# Altium schematic sheet BluePillShematic.SchDoc
size A
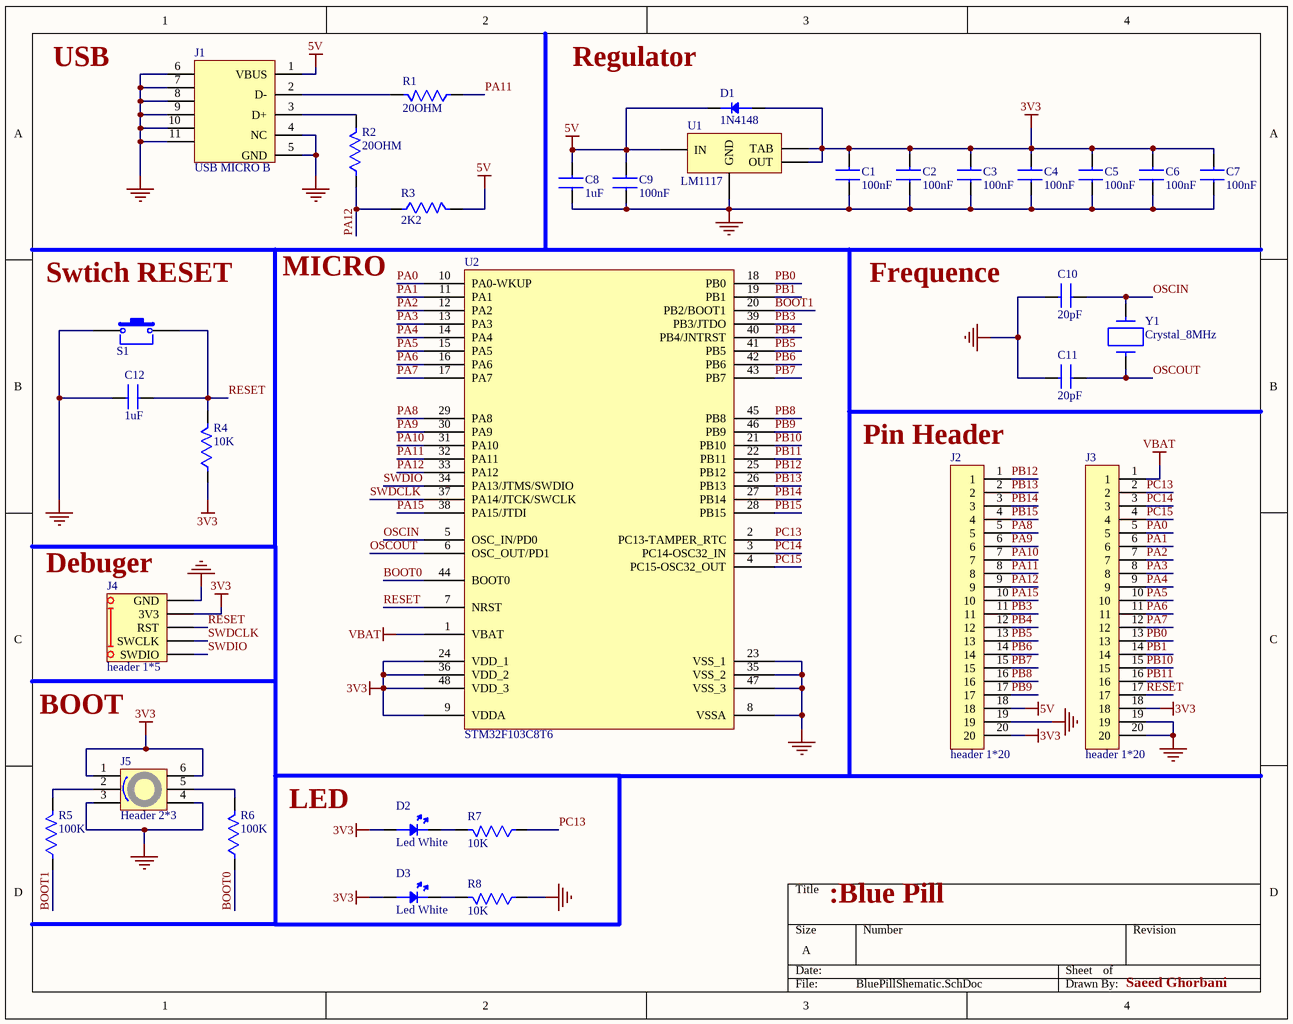
[diagram p0: BluePillShematic.SchDoc]

## Parts
C1  100nF  [C0805]
C2  100nF  [C0805]
C3  100nF  [C0805]
C4  100nF  [C0805]
C5  100nF  [C0805]
C6  100nF  [C0805]
C7  100nF  [C0805]
C8  1uF  [C0805]
C9  100nF  [C0805]
C10  20pF  [C0805]
C11  20pF  [C0805]
C12  1uF  [C0805]
D1  1N4148  [DO-213-A]
D2  Led White  [LED0603]
D3  Led White  [LED0603]
J1  USB MICRO B  [USB]
J2  header 1*20  [header 1*20]
J3  header 1*20  [header 1*20]
J4  header 1*5  [header 1*5]
J5  Header 2*3  [header 2*3]
R1  20OHM  [R0805]
R2  20OHM  [R0805]
R3  2K2  [R0805]
R4  10K  [R0805]
R5  100K  [R0805]
R6  100K  [R0805]
R7  10K  [R0805]
R8  10K  [R0805]
S1  PTS636SMG25JSMTRLFS  [Switch Reset]  (value not drawn)
U1  LM1117  [LM1117_SOP]
U2  STM32F103C8T6  [TQFP48]
Y1  Crystal_8MHz  [Crystal_8MHz]

## Nets
3V3: C1.2 C2.2 C3.2 C4.2 C5.2 C6.2 C7.2 D1.A(Anode) D2.A(Anode) D3.A(Anode) J2.20 J3.18 J4.2(3V3) J5.1 J5.6 R4.1 U1.2(OUT) U1.4(TAB) U2.9(VDDA) U2.24(VDD_1) U2.36(VDD_2) U2.48(VDD_3)
5V: C8.2 C9.2 D1.K(Cathode) J1.1(VBUS) J2.18 R3.2 U1.3(IN)
GND: C1.1 C2.1 C3.1 C4.1 C5.1 C6.1 C7.1 C8.1 C9.1 C10.1 C11.1 C12.1 J1.4(NC) J1.5(GND) J1.6(GND) J1.7(GND) J1.8(GND) J1.9(GND) J1.10(GND) J1.11(GND) J2.19 J3.19 J3.20 J4.1(GND) J5.3 J5.4 R8.1 S1.1 U1.1(GND) U2.8(VSSA) U2.23(VSS_1) U2.35(VSS_2) U2.47(VSS_3)
VBAT: J3.1 U2.1(VBAT)
BOOT0: R6.1 U2.44(BOOT0)
BOOT1: R5.1 U2.20(PB2/BOOT1)
OSCIN: C10.2 U2.5(OSC_IN/PD0) Y1.2
OSCOUT: C11.2 U2.6(OSC_OUT/PD1) Y1.1
PA0: J3.5 U2.10(PA0-WKUP)
PA1: J3.6 U2.11(PA1)
PA2: J3.7 U2.12(PA2)
PA3: J3.8 U2.13(PA3)
PA4: J3.9 U2.14(PA4)
PA5: J3.10 U2.15(PA5)
PA6: J3.11 U2.16(PA6)
PA7: J3.12 U2.17(PA7)
PA8: J2.5 U2.29(PA8)
PA9: J2.6 U2.30(PA9)
PA10: J2.7 U2.31(PA10)
PA11: J2.8 R1.1 U2.32(PA11)
PA12: J2.9 R2.1 R3.1 U2.33(PA12)
PA15: J2.10 U2.38(PA15/JTDI)
PB0: J3.13 U2.18(PB0)
PB1: J3.14 U2.19(PB1)
PB3: J2.11 U2.39(PB3/JTDO)
PB4: J2.12 U2.40(PB4/JNTRST)
PB5: J2.13 U2.41(PB5)
PB6: J2.14 U2.42(PB6)
PB7: J2.15 U2.43(PB7)
PB8: J2.16 U2.45(PB8)
PB9: J2.17 U2.46(PB9)
PB10: J3.15 U2.21(PB10)
PB11: J3.16 U2.22(PB11)
PB12: J2.1 U2.25(PB12)
PB13: J2.2 U2.26(PB13)
PB14: J2.3 U2.27(PB14)
PB15: J2.4 U2.28(PB15)
PC13: J3.2 R7.1 U2.2(PC13-TAMPER_RTC)
PC14: J3.3 U2.3(PC14-OSC32_IN)
PC15: J3.4 U2.4(PC15-OSC32_OUT)
RESET: C12.2 J3.17 J4.3(RST) R4.2 S1.2 U2.7(NRST)
SWDCLK: J4.4(SWCLK) U2.37(PA14/JTCK/SWCLK)
SWDIO: J4.5(SWDIO) U2.34(PA13/JTMS/SWDIO)
NetD2_K: D2.K(Cathode) R7.2
NetD3_K: D3.K(Cathode) R8.2
NetJ1_2: J1.2(D-) R1.2
NetJ1_3: J1.3(D+) R2.2
NetJ5_2: J5.2 R5.2
NetJ5_5: J5.5 R6.2

## Notes on the sheet
- USB
- (near D1) Regulator
- (near S1) Swtich RESET
- MICRO
- Frequence
- (near J2) Pin Header
- (near J4) Debuger
- BOOT
- LED
- :Blue Pill
- Saeed Ghorbani

## Library data of the parts
C1-C7 C9 = C0805_100nF: Cap Ceramic 0.1uF 50V X7R 10% Pad SMD 0805 (1%FR) 125C; Manufacturer: KEMET; Manufacturer Part Number: M3253504E2A104KZMB; Supplier 1: Digi-Key; RoHS: No; Stock 1: 3225; Pricing 1: 1=6.48000, 10=5.76300, 50=5.04240, 100=4.61010, 500=3.96184, 1000=3.67371 (USD); RoHS Compliant: No; ComponentLink1URL: https://api.kemet.com/component-edge/download/datasheet/M3253504E2A104KZMB.pdf?src-supplier=Digi-Key; ComponentLink1Description: https://api.kemet.com/component-edge/download/datasheet/M3253504E2A104KZMB.pdf?src-supplier=Digi-Key; Supplier Part Number 1: 1001-2517-1-ND
C8 C12 = C0805_1uF: KEMET         C0805C105K5PACTU             SMD Multilayer Ceramic Capacitor, 0805 [2012 Metric], 1 F, 50 V,  10%, X5R, C Series; Voltage Rating: 50V; Supplier 1: Digi-Key; Manufacturer: KEMET; Manufacturer Part Number: C0805C105K5PACTU; RoHS: Yes; Category: Ceramic Capacitors; Stock 1: 4156; Pricing 1: 1=0.37000, 10=0.25000, 50=0.16700, 100=0.14190, 500=0.10018, 1000=0.08766 (USD); Mount: Surface Mount; Case/Package: 0805; Dielectric Material: Ceramic; Case Code (Metric): 2012; Case Code (Imperial): 0805; Weight: 0.000194oz; Min Operating Temperature: -55°C; Max Operating Temperature: 85°C; Dielectric: X5R; Packaging: Tape and Reel; Tolerance: 10%; Capacitance: 1uF; Termination: SMD/SMT; Voltage Rating (DC): 50V; Package Quantity: 2500; Length: 0.079inch; Width: 0.049inch; Thickness: 0.055inch; Lead Free: Lead Free; REACH SVHC: No SVHC; ComponentLink1URL: http://www.farnell.com/datasheets/2746140.pdf?src-supplier=Farnell; ComponentLink1Description: http://www.farnell.com/datasheets/2746140.pdf?src-supplier=Farnell; ComponentLink2URL: http://www.mouser.com/ds/2/212/KEM_C1006_X5R_SMD-1103249.pdf?src-supplier=Mouser; ComponentLink2Description: http://www.mouser.com/ds/2/212/KEM_C1006_X5R_SMD-1103249.pdf?src-supplier=Mouser; ComponentLink3URL: https://api.kemet.com/component-edge/download/datasheet/C0805C105K5PAC7800.pdf?src-supplier=Digi-Key; ComponentLink3Description: https://api.kemet.com/component-edge/download/datasheet/C0805C105K5PAC7800.pdf?src-supplier=Digi-Key; ComponentLink4URL: http://www.farnell.com/datasheets/2746140.pdf?src-supplier=Newark; ComponentLink4Description: http://www.farnell.com/datasheets/2746140.pdf?src-supplier=Newark; ComponentLink5URL: http://www.farnell.com/datasheets/2032728.pdf?src-supplier=Element14; ComponentLink5Description: http://www.farnell.com/datasheets/2032728.pdf?src-supplier=Element14; Supplier Part Number 1: 399-15436-1-ND
C10 C11 = C0805_20pF: Cap Ceramic 20pF 50V C0G 10% SMD 0805 125°C Paper T/R; Manufacturer: KEMET; Manufacturer Part Number: C0805C200K5GAC7800; Supplier 1: Digi-Key; RoHS: Yes; Category: Ceramic Capacitors; Stock 1: 273; Pricing 1: 1=0.29000, 10=0.19700, 50=0.13120, 100=0.11140, 500=0.07866, 1000=0.06883 (USD); Case/Package: 0805; Dielectric Material: Ceramic; Voltage Rating (DC): 50V; Capacitance: 20pF; Tolerance: 10%; Lead Free: Lead Free; ComponentLink1URL: https://api.kemet.com/component-edge/download/datasheet/C0805C200K5GACTU.pdf?src-supplier=Digi-Key; ComponentLink1Description: https://api.kemet.com/component-edge/download/datasheet/C0805C200K5GACTU.pdf?src-supplier=Digi-Key; Supplier Part Number 1: 399-14568-1-ND
D1 = 1N4148UR-1: Diode Switching 75V 0.2A 2-Pin DO-213AA; Manufacturer: Microsemi; Max Reverse Current: 500nA; Element Configuration: Single; Average Rectified Current: 200mA; Reverse Recovery Time: 5ns; Peak Non-Repetitive Surge Current: 2A; Forward Voltage: 1.2V; Supplier 1: Newark; Manufacturer Part Number: 1N4148UR-1; RoHS: No; Category: Rectifier Diodes; Pricing 1: 491=0.66300 (USD); Mount: Surface Mount; Number of Pins: 2; Min Operating Temperature: -65°C; Max Operating Temperature: 175°C; Max Repetitive Reverse Voltage (Vrrm): 75V; Max Reverse Voltage (DC): 75V; Forward Current: 200mA; Packaging: Bulk; Radiation Hardening: No; Lead Free: Lead Free; ComponentLink1URL: https://datasheet.ciiva.com/3304/lds-0281-1-3304223.pdf?src-supplier=Avnet; ComponentLink1Description: https://datasheet.ciiva.com/3304/lds-0281-1-3304223.pdf?src-supplier=Avnet; Supplier Part Number 1: 34AJ8178
D2 D3 = LED0603: Led White Clear 0603 SMD; Manufacturer: Inolux; Manufacturer Part Number: IN-S63AT5UW; Lens Style: Flat; Luminous Intensity: 900mcd; Forward Voltage: 3V; Test Current: 5mA; Viewing Angle: 120°; Lens Size: 0.8mm; Supplier 1: Digi-Key; RoHS: No; Category: LEDs; Stock 1: 294296; Pricing 1: 1=0.34000, 10=0.18600, 100=0.08610, 500=0.07950, 1000=0.06228, 2000=0.06095 (USD); Mount: Surface Mount; Case/Package: 0603; Color: White; Lens Color: Clear; Case Code (Imperial): 0603; Case Code (Metric): 1608; Packaging: Tape and Reel; Lens Transparency: Clear; Length: 1.6mm; Width: 0.8mm; Height: 0.4mm; ComponentLink1URL: http://www.inolux-corp.com/datasheet/SMDLED/Mono%20Color%20Top%20View/IN-S63AT%20Series_V1.1.pdf?src-supplier=Digi-Key; ComponentLink1Description: http://www.inolux-corp.com/datasheet/SMDLED/Mono%20Color%20Top%20View/IN-S63AT%20Series_V1.1.pdf?src-supplier=Digi-Key; Supplier Part Number 1: 1830-1063-1-ND
J1 = USB MICRO B: CONN USB MICRO B RECPT SMT R/A; Manufacturer: Amphenol ICC / FCI; Manufacturer Part Number: 10118194-0001LF; Supplier 1: Newark; RoHS: No; Category: USB Connectors; Stock 1: 24134; Pricing 1: 1=0.24700, 25=0.24700, 100=0.24700, 250=0.22600, 500=0.22600 (USD); ComponentLink1URL: http://components.arrow.com/part/dataview/0323_04107373?src-supplier=Arrow+Europe; ComponentLink1Description: http://components.arrow.com/part/dataview/0323_04107373?src-supplier=Arrow+Europe; ComponentLink2URL: https://cdn.amphenol-icc.com/media/wysiwyg/files/drawing/10118194.pdf?src-supplier=Avnet; ComponentLink2Description: https://cdn.amphenol-icc.com/media/wysiwyg/files/drawing/10118194.pdf?src-supplier=Avnet; ComponentLink3URL: http://www.farnell.com/datasheets/2366786.pdf?src-supplier=Newark; ComponentLink3Description: http://www.farnell.com/datasheets/2366786.pdf?src-supplier=Newark; ComponentLink4URL: https://cdn.amphenol-icc.com/media/wysiwyg/files/drawing/10118194.pdf?src-supplier=Mouser; ComponentLink4Description: https://cdn.amphenol-icc.com/media/wysiwyg/files/drawing/10118194.pdf?src-supplier=Mouser; ComponentLink5URL: http://www.amphenol-icc.com/media/wysiwyg/files/drawing/10118194.pdf?src-supplier=Digi-Key; ComponentLink5Description: http://www.amphenol-icc.com/media/wysiwyg/files/drawing/10118194.pdf?src-supplier=Digi-Key; ComponentLink6URL: http://www.farnell.com/cad/2354948.pdf?src-supplier=Farnell; ComponentLink6Description: http://www.farnell.com/cad/2354948.pdf?src-supplier=Farnell; ComponentLink7URL: https://cdn.amphenol-icc.com/media/wysiwyg/files/drawing/10118194.pdf?src-supplier=RSComponents; ComponentLink7Description: https://cdn.amphenol-icc.com/media/wysiwyg/files/drawing/10118194.pdf?src-supplier=RSComponents; ComponentLink8URL: https://cdn.amphenol-icc.com/media/wysiwyg/files/drawing/10118194.pdf?src-supplier=Allied+Electronics; ComponentLink8Description: https://cdn.amphenol-icc.com/media/wysiwyg/files/drawing/10118194.pdf?src-supplier=Allied+Electronics; ComponentLink9URL: https://cdn.amphenol-icc.com/media/wysiwyg/files/drawing/10118194.pdf?src-supplier=Verical; ComponentLink9Description: https://cdn.amphenol-icc.com/media/wysiwyg/files/drawing/10118194.pdf?src-supplier=Verical; ComponentLink10URL: https://cdn.amphenol-icc.com/media/wysiwyg/files/drawing/10118194.pdf?src-supplier=Arrow+Electronics; ComponentLink10Description: https://cdn.amphenol-icc.com/media/wysiwyg/files/drawing/10118194.pdf?src-supplier=Arrow+Electronics; ComponentLink11URL: https://cdn.amphenol-icc.com/media/wysiwyg/files/drawing/10118194.pdf?src-supplier=TTI; ComponentLink11Description: https://cdn.amphenol-icc.com/media/wysiwyg/files/drawing/10118194.pdf?src-supplier=TTI; ComponentLink12URL: https://cdn.amphenol-icc.com/media/wysiwyg/files/drawing/10118194.pdf?src-supplier=NAC+Semi; ComponentLink12Description: https://cdn.amphenol-icc.com/media/wysiwyg/files/drawing/10118194.pdf?src-supplier=NAC+Semi; ComponentLink13URL: https://cdn.amphenol-icc.com/media/wysiwyg/files/drawing/10118194.pdf?src-supplier=SOS+electronic; ComponentLink13Description: https://cdn.amphenol-icc.com/media/wysiwyg/files/drawing/10118194.pdf?src-supplier=SOS+electronic; ComponentLink14URL: https://cdn.amphenol-icc.com/media/wysiwyg/files/drawing/10118194.pdf?src-supplier=Quest; ComponentLink14Description: https://cdn.amphenol-icc.com/media/wysiwyg/files/drawing/10118194.pdf?src-supplier=Quest; ComponentLink15URL: https://cdn.amphenol-icc.com/media/wysiwyg/files/drawing/10118194.pdf?src-supplier=Heilind+Electronics; ComponentLink15Description: https://cdn.amphenol-icc.com/media/wysiwyg/files/drawing/10118194.pdf?src-supplier=Heilind+Electronics; ComponentLink16URL: https://cdn.amphenol-icc.com/media/wysiwyg/files/drawing/10118194.pdf?src-supplier=TME; ComponentLink16Description: https://cdn.amphenol-icc.com/media/wysiwyg/files/drawing/10118194.pdf?src-supplier=TME; Supplier Part Number 1: 67T2260
J2 J3 = header 1*20: 2.54mm (0.1") Pitch SIL Vertical PC Tail Pin Header, 6.1mm mating pin height, gold (hi-temp mould), 20 contacts; Manufacturer: Harwin; Manufacturer Part Number: M20-9992045; Max Current Rating: 3A; Contact Resistance: 25mR; Connector Type: Male Pin; Number of Positions: 20; Gender: Male; Supplier 1: Digi-Key; RoHS: Yes; Category: Headers and Wire Housings; Stock 1: 74; Pricing 1: 1=0.75000, 10=0.65900, 100=0.56880, 500=0.46540, 1000=0.41370, 5000=0.36198, 10000=0.34389 (USD); Mount: Through Hole; Case/Package: SIL; Housing Color: Black; Contact Plating: Gold; Color: Black; Contact Material: Brass; Housing Material: Nylon; Min Operating Temperature: -40°C; Max Operating Temperature: 105°C; Packaging: Bulk; Package Quantity: 200; Termination: Solder; Orientation: Straight; Number of Rows: 1; Number of Contacts: 20; Length: 50.8mm; Pitch: 2.54mm; Contact Mating Length: 0.24inch; Depth: 2.54mm; Radiation Hardening: No; ComponentLink1URL: https://datasheet.ciiva.com/5159/m20-999-351179-5159781.pdf?src-supplier=Mouser; ComponentLink1Description: https://datasheet.ciiva.com/5159/m20-999-351179-5159781.pdf?src-supplier=Mouser; Supplier Part Number 1: 952-3306-ND
J4 = header 1*5: M20 Header,  Pin,  Sil,  Vertical,  5 W; Manufacturer: Harwin; Manufacturer Part Number: M20-9990545; Number of Positions: 5; Connector Type: Male Pin; Gender: Male; Max Current Rating: 3A; Contact Resistance: 25mR; Insulation Resistance: 10GR; Pitch: 2.54mm; Supplier 1: Digi-Key; RoHS: Yes; Category: Headers and Wire Housings; Stock 1: 4725; Pricing 1: 1=0.26000, 10=0.24200, 100=0.16810, 500=0.14220, 1000=0.11635, 5000=0.10342, 10000=0.09373 (USD); Mount: Through Hole; Case/Package: SIL; Housing Material: Nylon; Color: Black; Housing Color: Black; Weight: 0.1lb; Contact Plating: Gold; Contact Material: Brass,Bronze; Min Operating Temperature: -40°C; Max Operating Temperature: 105°C; Termination: Solder; Number of Contacts: 5; Number of Rows: 1; Packaging: Bag; Orientation: Straight; Package Quantity: 1000; Current Rating: 3A; Length: 12.7mm; Width: 0.5inch; Height: 0.12inch; Depth: 2.54mm; Contact Mating Length: 0.24inch; Radiation Hardening: No; REACH SVHC: No SVHC; ComponentLink1URL: https://datasheet.ciiva.com/11753/0900766b80da602d-11753877.pdf?src-supplier=RSComponents; ComponentLink1Description: https://datasheet.ciiva.com/11753/0900766b80da602d-11753877.pdf?src-supplier=RSComponents; ComponentLink2URL: https://datasheet.ciiva.com/9479/m20-999-9479623.pdf?src-supplier=Avnet; ComponentLink2Description: https://datasheet.ciiva.com/9479/m20-999-9479623.pdf?src-supplier=Avnet; ComponentLink3URL: https://datasheet.ciiva.com/8046/315376-8046938.pdf?src-supplier=Element14; ComponentLink3Description: https://datasheet.ciiva.com/8046/315376-8046938.pdf?src-supplier=Element14; ComponentLink4URL: https://datasheet.ciiva.com/6814/m20-999-6814798.pdf?src-supplier=Digi-Key; ComponentLink4Description: https://datasheet.ciiva.com/6814/m20-999-6814798.pdf?src-supplier=Digi-Key; ComponentLink5URL: https://datasheet.ciiva.com/16657/m20-999-16657087.pdf?src-supplier=Avnet+Europe; ComponentLink5Description: https://datasheet.ciiva.com/16657/m20-999-16657087.pdf?src-supplier=Avnet+Europe; Supplier Part Number 1: 952-2267-ND
J5 = Header 2*3: HARWIN - M20-9980345 - Board-To-Board Connector, Vertical, 2.54 mm, 6 Contacts, Header, M20 Series, Through Hole, 2 Rows; Max Current Rating: 3A; Contact Resistance: 25mR; Number of Positions: 6; Gender: Male; Connector Type: Male Pin; Insulation Resistance: 10GR; Pitch: 2.54mm; Row Spacing: 0.1inch; Supplier 1: Digi-Key; Manufacturer: Harwin; Manufacturer Part Number: M20-9980345; RoHS: Yes; Category: Headers and Wire Housings; Stock 1: 3339; Pricing 1: 1=0.29000, 10=0.27600, 100=0.19300, 500=0.16544, 1000=0.13786, 5000=0.11817, 10000=0.11029 (USD); Mount: Through Hole; Contact Material: Brass,Bronze; Color: Black; Housing Color: Black; Housing Material: Nylon; Contact Plating: Gold; Weight: 0.125lb; Insulation Material: Polyester; Min Operating Temperature: -40°C; Max Operating Temperature: 105°C; Package Quantity: 1000; Number of Rows: 2; Packaging: Bag; Termination: Solder; Number of Contacts: 6; Orientation: Straight; Current Rating: 3A; Series: M20; Contact Type: Male Pin; Length: 7.62mm; Width: 0.25inch; Height: 0.125inch; Depth: 5.08mm; Contact Mating Length: 0.24inch; Radiation Hardening: No; REACH SVHC: No SVHC; RoHS Compliant: Yes; ComponentLink1URL: https://datasheet.ciiva.com/6789/91635-6789923.pdf?src-supplier=Newark; ComponentLink1Description: https://datasheet.ciiva.com/6789/91635-6789923.pdf?src-supplier=Newark; ComponentLink2URL: https://datasheet.ciiva.com/11746/0900766b80da602b-11746662.pdf?src-supplier=RSComponents; ComponentLink2Description: https://datasheet.ciiva.com/11746/0900766b80da602b-11746662.pdf?src-supplier=RSComponents; ComponentLink3URL: https://datasheet.ciiva.com/26852/getdatasheetpartid-420465-26852189.pdf?src-supplier=Verical; ComponentLink3Description: https://datasheet.ciiva.com/26852/getdatasheetpartid-420465-26852189.pdf?src-supplier=Verical; ComponentLink4URL: https://datasheet.ciiva.com/6830/m20-998-6830775.pdf?src-supplier=Digi-Key; ComponentLink4Description: https://datasheet.ciiva.com/6830/m20-998-6830775.pdf?src-supplier=Digi-Key; ComponentLink5URL: https://datasheet.ciiva.com/8046/112195-8046904.pdf?src-supplier=Element14; ComponentLink5Description: https://datasheet.ciiva.com/8046/112195-8046904.pdf?src-supplier=Element14; Supplier Part Number 1: 952-2120-ND
R1 R2 = R0805_20OHM: RES SMD 20 OHM 0.1% 1/8W 0805; Manufacturer: Yageo; Manufacturer Part Number: RT0805BRD0720RL; Resistance: 20R; Power Rating: 125mW; Voltage Rating: 150V; Temperature Coefficient: 25ppm/°C; Supplier 1: Digi-Key; RoHS: Yes; Category: Chip SMD Resistors; Stock 1: 12923; Pricing 1: 1=0.36000, 10=0.25900, 100=0.10350, 1000=0.05102, 2500=0.04726 (USD); Case/Package: 0805; Case Code (Metric): 2012; Case Code (Imperial): 0805; Min Operating Temperature: -55°C; Max Operating Temperature: 125°C; Package Quantity: 5000; Packaging: Tape and Reel; Tolerance: 0.1%; Resistor Type: Thin Film; Number of Terminations: 2; Termination: SMD/SMT; Max Power Dissipation: 125mW; Voltage Rating (DC): 150V; Series: RT; Length: 0.079inch; Width: 0.049inch; Height: 0.024inch; Lead Free: Lead Free; RoHS Compliant: Yes; ComponentLink1URL: https://datasheet.ciiva.com/2584/pyu-rt-1-to-0-05-rohs-l-5-2584837.pdf?src-supplier=Digi-Key; ComponentLink1Description: https://datasheet.ciiva.com/2584/pyu-rt-1-to-0-05-rohs-l-5-2584837.pdf?src-supplier=Digi-Key; ComponentLink2URL: https://datasheet.ciiva.com/12703/pyu-rt-1-to-0-05-rohs-l-4-12703895.pdf?src-supplier=Mouser; ComponentLink2Description: https://datasheet.ciiva.com/12703/pyu-rt-1-to-0-05-rohs-l-4-12703895.pdf?src-supplier=Mouser; Supplier Part Number 1: YAG4856CT-ND
R3 = R0805_2K2: Res Thick Film 0805 2.2K Ohm 5% 0.125W(1/8W) ±100ppm/C Epoxy Pad SMD T/R; Manufacturer: Yageo; Manufacturer Part Number: RC0805JR-072K2L; Resistance: 2.2kR; Power Rating: 125mW; Voltage Rating: 150V; Temperature Coefficient: 100ppm/°C; Supplier 1: Digi-Key; RoHS: Yes; Category: Chip SMD Resistors; Stock 1: 35990; Pricing 1: 1=0.10000, 10=0.03600, 100=0.01450, 1000=0.00652, 2500=0.00566 (USD); Case/Package: 0805; Case Code (Imperial): 0805; Case Code (Metric): 2012; Contact Plating: Tin,Lead,Matte; Size Code: 0805; Min Operating Temperature: -55°C; Max Operating Temperature: 155°C; Tolerance: 5%; Packaging: Tape and Reel; Termination: SMD/SMT; Resistor Type: Thick Film; Features: Moisture Resistant; Series: RC; Max Power Dissipation: 125mW; Number of Terminations: 2; Construction: Rectangular; Resistance Tolerance: 5%; Length: 2mm; Depth: 1.25mm; Radiation Hardening: No; REACH SVHC: Unknown; Military Standard: Not; Lead Free: Lead Free; RoHS Compliant: Yes; ComponentLink1URL: https://datasheet.ciiva.com/12667/rc0805-12667397.pdf?src-supplier=Mouser; ComponentLink1Description: https://datasheet.ciiva.com/12667/rc0805-12667397.pdf?src-supplier=Mouser; ComponentLink2URL: https://datasheet.ciiva.com/15190/getdatasheetpartid-251869-15190044.pdf?src-supplier=Verical; ComponentLink2Description: https://datasheet.ciiva.com/15190/getdatasheetpartid-251869-15190044.pdf?src-supplier=Verical; ComponentLink3URL: https://datasheet.ciiva.com/7941/442941-7941935.pdf?src-supplier=Element14; ComponentLink3Description: https://datasheet.ciiva.com/7941/442941-7941935.pdf?src-supplier=Element14; Supplier Part Number 1: 311-2.2KARCT-ND
R4 R7 R8 = R0805_10K: Res Thick Film 0805 10K Ohm 1% 0.5W(1/2W) ±200ppm/C Pad SMD Automotive T/R; Manufacturer: Yageo; Manufacturer Part Number: SR0805FR-4710KL; Resistance: 10kR; Max Power Dissipation: 500mW; Temperature Coefficient: 200ppm/°C; Supplier 1: Digi-Key; RoHS: Yes; Category: Chip SMD Resistors; Stock 1: 6672; Pricing 1: 1=0.71000, 10=0.52600, 100=0.30630, 1000=0.17176, 2500=0.16582 (USD); Case/Package: 0805; Case Code (Imperial): 0805; Case Code (Metric): 2012; Min Operating Temperature: -55°C; Max Operating Temperature: 155°C; Resistor Type: Thick Film; Features: Automotive AEC-Q200; Packaging: Tape and Reel; Tolerance: 1%; Number of Terminations: 2; RoHS Compliant: Yes; ComponentLink1URL: http://www.yageo.com/documents/recent/PYu-SR_D_F%20tol_RoHS_L_3.pdf?src-supplier=Digi-Key; ComponentLink1Description: http://www.yageo.com/documents/recent/PYu-SR_D_F%20tol_RoHS_L_3.pdf?src-supplier=Digi-Key; Supplier Part Number 1: YAG5846CT-ND
R5 R6 = R0805_100K: Manufacturer: Yageo; Manufacturer Part Number: AC0805FR-7W100KL; Supplier 1: Digi-Key; RoHS: Yes; Category: Resistors; Stock 1: 2889; Pricing 1: 1=0.10000, 10=0.08400, 100=0.03240, 1000=0.01424, 2500=0.01230 (USD); RoHS Compliant: Yes; Supplier Part Number 1: 13-AC0805FR-7W100KLCT-ND
S1 = Switch Reset: Manufacturer: ITT C&K; Supplier 1: Future Electronics; Manufacturer Part Number: PTS636SMG25JSMTRLFS; RoHS: No; Pricing 1: 3000=0.09210, 6000=0.07530, 9000=0.07460, 15000=0.07370 (USD); Supplier Part Number 1: 7113405
U1 = LM1117: LDO VOLTAGE REGULATOR, 3.3V, 0.8A, SOT-223-4; Input Voltage Min:2.6V; Input Voltage Max:15V; Output Current:800mA; Dropout Voltage Vdo:1.2V; LDO Regulator Case Style:SOT-223; No. of Pins:4; Operating Temperature Min:0°C ;RoHS Compliant: Yes; Manufacturer: TI National Semiconductor; Manufacturer Part Number: LM1117MP-3.3/NOPB; Max Input Voltage: 15V; Dropout Voltage: 1.2V; Number of Outputs: 1; Max Output Current: 800mA; Polarity: Positive; Quiescent Current: 10mA; Output Voltage Accuracy: 1%; Output Type: Fixed; Supplier 1: Digi-Key; RoHS: Yes; Category: Voltage Regulators - Linear; Stock 1: 42495; Pricing 1: 1=1.17000, 10=1.04400, 25=0.99120, 100=0.81430, 250=0.76120, 500=0.67268 (USD); Mount: Surface Mount; Case/Package: SOT-223; Number of Pins: 4; Min Operating Temperature: 0°C; Max Operating Temperature: 125°C; Output Voltage: 3.3V; Packaging: Tape and Reel; Package Quantity: 1000; Output Current: 800mA; Number of Regulators: 1; Min Current Limit: 800mA; Nominal Output Voltage: 3.3V; Accuracy: 1%; Current Rating: 800mA; Length: 6.5mm; Width: 3.56mm; Height: 1.6mm; Radiation Hardening: No; REACH SVHC: No SVHC; Lead Free: Lead Free; Supplier Part Number 1: LM1117MP-3.3/NOPBCT-ND
U2 = STM32F103C8T6: STMICROELECTRONICS - STM32F103C8T6 - ARM MCU, Motor Control, STM32 Family STM32F1 Series Microcontrollers, ARM Cortex-M3, 32bit, 72 MHz; RAM Size: 20KB; Frequency: 72MHz; Density: 64KB; Number of Bits: 32; Max Power Dissipation: 363mW; Interface: I2C,SPI,USB,CAN,IrDA,UART,USART,LIN; Number of I/Os: 37; Number of Timers/Counters: 4; Max Supply Voltage: 3.6V; Number of PWM Channels: 1; Number of ADC Channels: 10; Min Supply Voltage: 2V; Oscillator Type: Internal; Number of Programmable I/O: 48; Data Bus Width: 32b; Memory Type: FLASH; Number of SPI Channels: 2; Watchdog Timer: Yes; Peripherals: POR,PWM,WDT,DMA,Temp Sensor,I2C; Supplier 1: Newark; Manufacturer: STMicroelectronics; Manufacturer Part Number: STM32F103C8T6; RoHS: Yes; Category: Microcontrollers; Pricing 1: 1=6.33000, 10=5.39000, 25=5.16000, 50=4.93000, 100=4.70000, 250=4.46000 (USD); Case/Package: LQFP; Number of Pins: 48; Min Operating Temperature: -40°C; Max Operating Temperature: 85°C; Packaging: Tray; Package Quantity: 250; Termination: SMD/SMT; Max Frequency: 72MHz; Number of I2C Channels: 2; Address Bus Width: 32b; Memory Size: 64KB; Core Architecture: ARM; Length: 7mm; Width: 7.2mm; Height: 1.45mm; Radiation Hardening: No; REACH SVHC: No SVHC; Lead Free: Lead Free; ComponentLink1URL: https://datasheet.ciiva.com/15122/getdatasheetpartid-69880-15122076.pdf?src-supplier=Verical; ComponentLink1Description: https://datasheet.ciiva.com/15122/getdatasheetpartid-69880-15122076.pdf?src-supplier=Verical; ComponentLink2URL: https://datasheet.ciiva.com/26816/stm32f103c8t6-26816902.pdf?src-supplier=IIIC; ComponentLink2Description: https://datasheet.ciiva.com/26816/stm32f103c8t6-26816902.pdf?src-supplier=IIIC; ComponentLink3URL: https://datasheet.ciiva.com/16210/cd00161566-16210248.pdf?src-supplier=Future+Electronics; ComponentLink3Description: https://datasheet.ciiva.com/16210/cd00161566-16210248.pdf?src-supplier=Future+Electronics; ComponentLink4URL: https://datasheet.ciiva.com/14100/pustm-arm-microcont-stm32f103-en-14100508.pdf?src-supplier=Distrelec; ComponentLink4Description: https://datasheet.ciiva.com/14100/pustm-arm-microcont-stm32f103-en-14100508.pdf?src-supplier=Distrelec; ComponentLink5URL: https://datasheet.ciiva.com/8054/1730126-8054942.pdf?src-supplier=Element14; ComponentLink5Description: https://datasheet.ciiva.com/8054/1730126-8054942.pdf?src-supplier=Element14; ComponentLink6URL: https://datasheet.ciiva.com/48687/001075658-da-01-en-mcu-64kb-mem-stm32f103c8t6-lqfp-48-stm-48687589.pdf?src-supplier=Conrad; ComponentLink6Description: https://datasheet.ciiva.com/48687/001075658-da-01-en-mcu-64kb-mem-stm32f103c8t6-lqfp-48-stm-48687589.pdf?src-supplier=Conrad; Supplier Part Number 1: 59M2182
Y1 = Crystal_8MHz: Crystal 8MHz ±30ppm (Tol) ±50ppm (Stability) 18pF FUND 60Ohm 2-Pin HC-49/USX SMD T/R; Manufacturer: ECS International; Manufacturer Part Number: ECS-80-18-5PX-TR; ESR (Equivalent Series Resistance): 60R; Supplier 1: Digi-Key; RoHS: Yes; Category: Crystals; Stock 1: 9598; Pricing 1: 1=0.45000, 10=0.37500, 50=0.33760, 100=0.30000, 500=0.28500 (USD); Mount: Surface Mount; Min Operating Temperature: -10°C; Max Operating Temperature: 70°C; Package Quantity: 1000; Frequency: 8MHz; Load Capacitance: 18pF; Packaging: Tape and Reel; Tolerance: 30ppm; Frequency Tolerance: 30ppm; Frequency Stability: 50ppm; Termination: SMD/SMT; Series: CSM-7X; Length: 0.449inch; Width: 4.8mm; Height: 0.169inch; Lead Free: Lead Free; RoHS Compliant: Yes; ComponentLink1URL: https://datasheet.ciiva.com/852/csm-7x-852380.pdf?src-supplier=Digi-Key; ComponentLink1Description: https://datasheet.ciiva.com/852/csm-7x-852380.pdf?src-supplier=Digi-Key; ComponentLink2URL: https://datasheet.ciiva.com/852/csm-7x-852381.pdf?src-supplier=Digi-Key; ComponentLink2Description: https://datasheet.ciiva.com/852/csm-7x-852381.pdf?src-supplier=Digi-Key; ComponentLink3URL: https://datasheet.ciiva.com/852/csm-7x-852382.pdf?src-supplier=Digi-Key; ComponentLink3Description: https://datasheet.ciiva.com/852/csm-7x-852382.pdf?src-supplier=Digi-Key; Supplier Part Number 1: XC1271CT-ND